# EAGLE design weather_station (EAGLE 9.6.2)
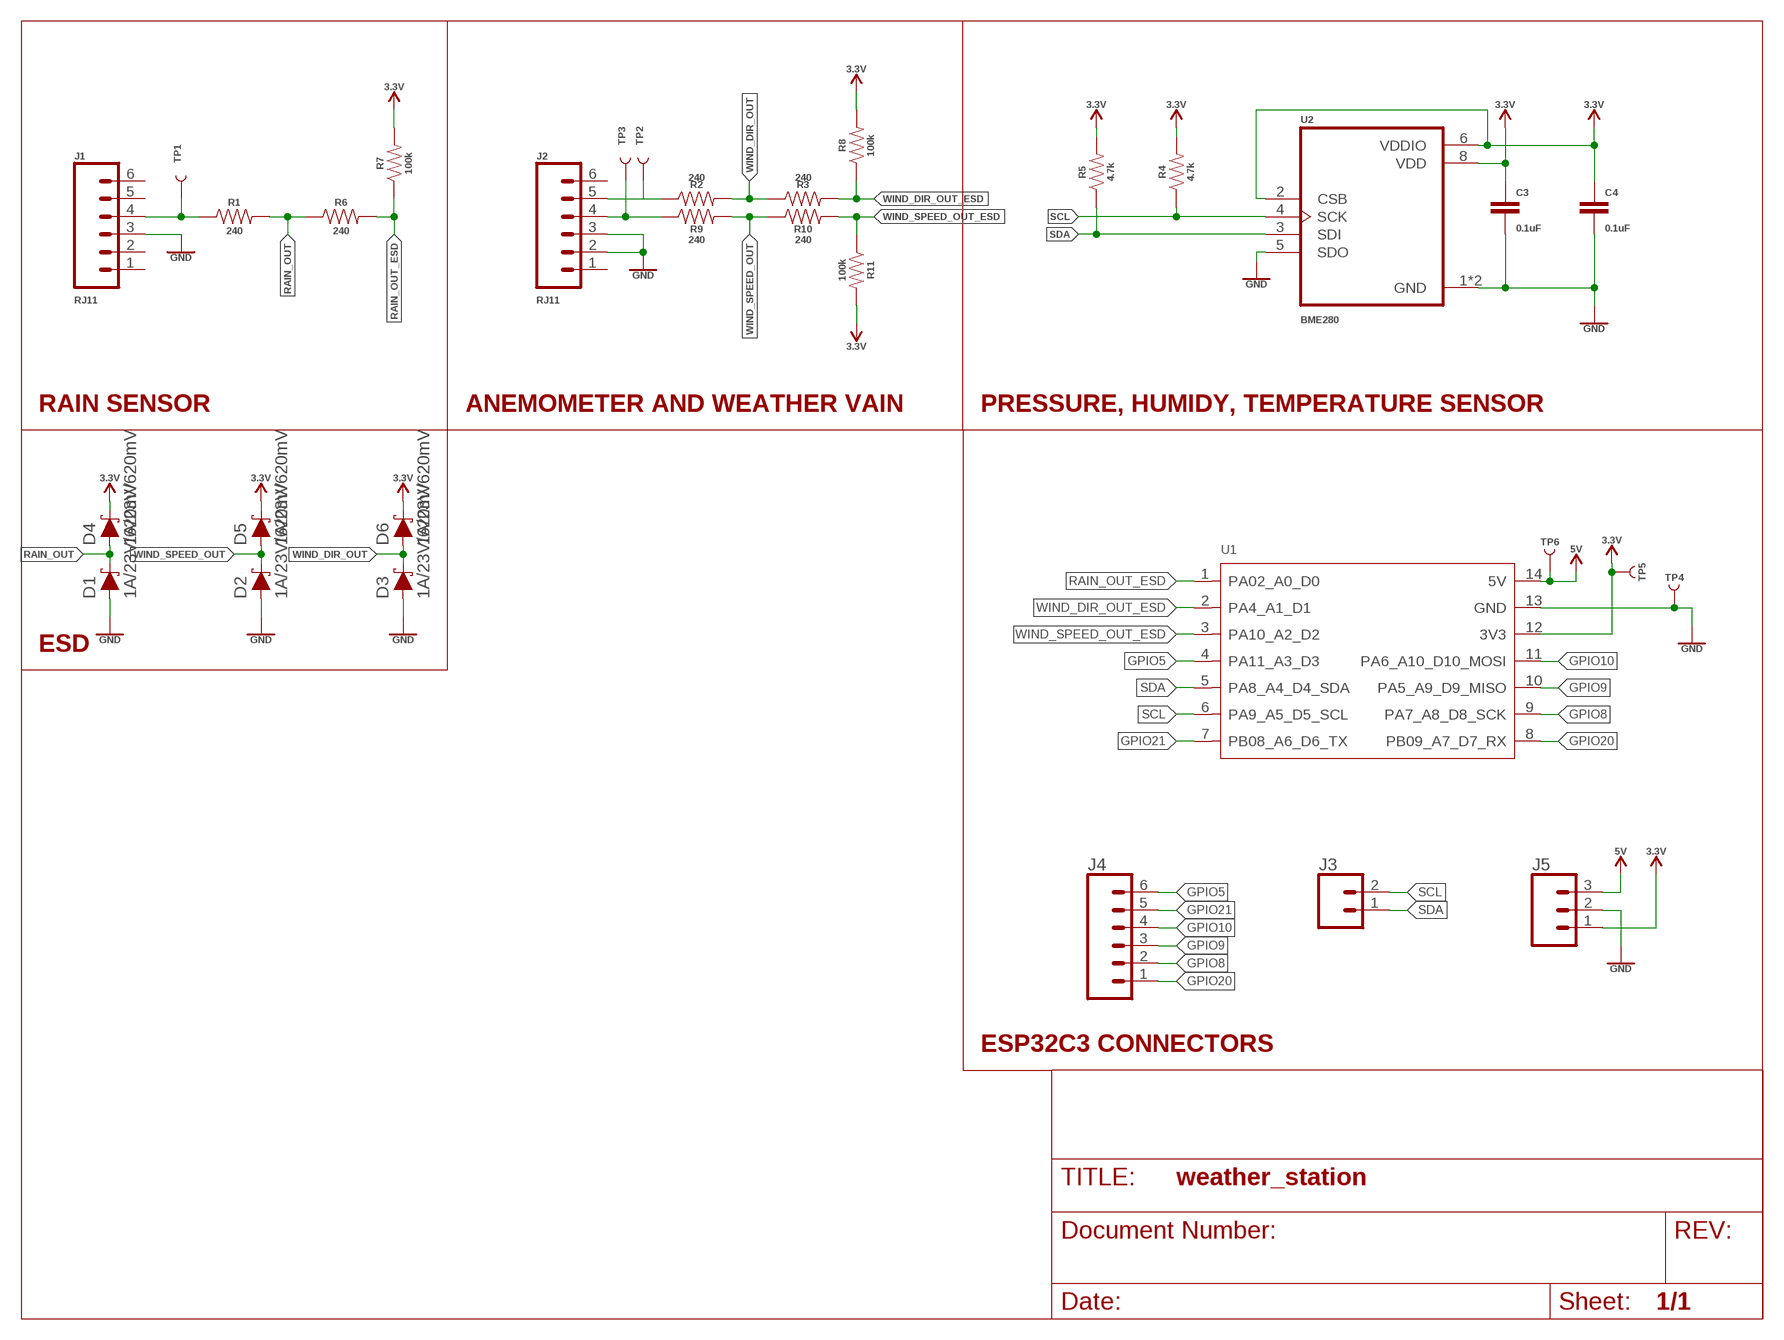
[diagram p0: schematic, sheet 1]

## Parts
C3  0.1uF  0.1UF-0603-25V-(+80/-20%)  [0603]
C4  0.1uF  0.1UF-0603-25V-(+80/-20%)  [0603]
D1  1A/23V/620mV  DIODE-SCHOTTKY-BAT20J  [SOD-323]
D2  1A/23V/620mV  DIODE-SCHOTTKY-BAT20J  [SOD-323]
D3  1A/23V/620mV  DIODE-SCHOTTKY-BAT20J  [SOD-323]
D4  1A/23V/620mV  DIODE-SCHOTTKY-BAT20J  [SOD-323]
D5  1A/23V/620mV  DIODE-SCHOTTKY-BAT20J  [SOD-323]
D6  1A/23V/620mV  DIODE-SCHOTTKY-BAT20J  [SOD-323]
J1  RJ11  RJ11-6  [RJ11-6]
J2  RJ11  RJ11-6  [RJ11-6]
J3  CONN_02  [1X02]
J4  CONN_06SILK_FEMALE_PTH  [1X06]
J5  CONN_03  [1X03]
R1  240  240OHM-0603-1/10W-1%  [0603]
R2  240  240OHM-0603-1/10W-1%  [0603]
R3  240  240OHM-0603-1/10W-1%  [0603]
R4  4.7k  4.7KOHM-0603-1/10W-1%  [0603]
R5  4.7k  4.7KOHM-0603-1/10W-1%  [0603]
R6  240  240OHM-0603-1/10W-1%  [0603]
R7  100k  100KOHM-0603-1/10W-1%  [0603]
R8  100k  100KOHM-0603-1/10W-1%  [0603]
R9  240  240OHM-0603-1/10W-1%  [0603]
R10  240  240OHM-0603-1/10W-1%  [0603]
R11  100k  100KOHM-0603-1/10W-1%  [0603]
TP1  TEST-POINT3  [PAD.03X.03]
TP2  TEST-POINT3  [PAD.03X.03]
TP3  TEST-POINT3  [PAD.03X.03]
TP4  TEST-POINT3  [PAD.03X.03]
TP5  TEST-POINT3  [PAD.03X.03]
TP6  TEST-POINT3  [PAD.03X.03]
U1  MODULE-SEEEDUINO-XIAO-ESP32C3-PIN  [MODULE14P-2.54-21X17.8MM]
U2  BME280  [PSON65P250X250X100-8N]

## Nets
3.3V [power]: C3.1 C4.1 D4.C D5.C D6.C J5.1 R4.2 R5.2 R7.2 R8.2 R11.2 TP5.P$1 U1.12(3V3) U2.2(CSB) U2.6(VDDIO) U2.8(VDD)
5V [power]: J5.3 TP6.P$1 U1.14(5V)
GND [power]: C3.2 C4.2 D1.A D2.A D3.A J1.3 J2.2 J2.3 J5.2 TP4.P$1 U1.13(GND) U2.1(GND) U2.5(SDO) U2.7(GND)
GPIO5 [signal]: J4.6 U1.4(PA11_A3_D3)
GPIO8 [signal]: J4.2 U1.9(PA7_A8_D8_SCK)
GPIO9 [signal]: J4.3 U1.10(PA5_A9_D9_MISO)
GPIO10 [signal]: J4.4 U1.11(PA6_A10_D10_MOSI)
GPIO20 [signal]: J4.1 U1.8(PB09_A7_D7_RX)
GPIO21 [signal]: J4.5 U1.7(PB08_A6_D6_TX)
RAIN_OUT [signal]: D1.C D4.A R1.2 R6.1
RAIN_OUT_ESD [signal]: R6.2 R7.1 U1.1(PA02_A0_D0)
RAIN_RAW [signal]: J1.4 R1.1 TP1.P$1
SCL [signal]: J3.2 R4.1 U1.6(PA9_A5_D5_SCL) U2.4(SCK)
SDA [signal]: J3.1 R5.1 U1.5(PA8_A4_D4_SDA) U2.3(SDI)
WIND_DIR_OUT [signal]: D3.C D6.A R2.2 R3.1
WIND_DIR_OUT_ESD [signal]: R3.2 R8.1 U1.2(PA4_A1_D1)
WIND_DIR_RAW [signal]: J2.5 R2.1 TP2.P$1
WIND_SPEED_OUT [signal]: D2.C D5.A R9.2 R10.1
WIND_SPEED_OUT_ESD [signal]: R10.2 R11.1 U1.3(PA10_A2_D2)
WIND_SPEED_RAW [signal]: J2.4 R9.1 TP3.P$1
Unconnected: J1.1 J1.2 J1.5 J1.6 J2.1 J2.6

## Notes on the sheet
- RAIN SENSOR | ANEMOMETER AND WEATHER VAIN | PRESSURE, HUMIDY, TEMPERATURE SENSOR
- ESD
- ESP32C3 CONNECTORS

## Library data of the parts
C3 C4 = SparkFun-Capacitors:0.1UF: 0.1µF ceramic capacitors A capacitor is a passive two-terminal electrical component used to store electrical energy temporarily in an electric field.; PROD_ID: CAP-00810
D1-D6 = SparkFun-DiscreteSemi:DIODE-SCHOTTKY: Schottky diode A Schottky diode is a semiconductor diode which has a low forward voltage drop and a very fast switching action.; PROD_ID: DIO-11623
J1 J2 = SparkFun-Connectors:RJ11-6: RJ11 Jack - 6 pin Commonly found on CAT3 devices and some Microchip programmers. Here is the connector we sell at SparkFun: RJ11 6-Pin Connector <https://www.sparkfun.com/products/132> (PRT-00132) Datasheet <http://www.sparkfun.com/datasheets/Prototyping/Connectors/RJ11-Datasheet.pdf> It is used on this SparkFun product: SparkFun Weather Shield <https://www.sparkfun.com/products/12081> (DEV-12081) Weather Meters <https://www.sparkfun.com/products/8942> (SEN-08942); PROD_ID: CONN-08590; SF_ID: PRT-00132
J3 = SparkFun-Connectors:CONN_02: Multi connection point. Often used as Generic Header-pin footprint for 0.1 inch spaced/style header connections On any of the 0.1 inch spaced packages, you can populate with these: Break Away Headers - Straight <https://www.sparkfun.com/products/116> (PRT-00116) Break Away Male Headers - Right Angle <https://www.sparkfun.com/products/553> (PRT-00553) Female Headers <https://www.sparkfun.com/products/115> (PRT-00115) Break Away Headers - Machine Pin <https://www.sparkfun.com/products/117> (PRT-00117) Break Away Female Headers - Swiss Machine Pin <https://www.sparkfun.com/products/743> (PRT-00743) For SCREWTERMINALS and SPRING TERMINALS visit here: Screw Terimnals on SparkFun.com <https://www.sparkfun.com/search/results?term=Screw+Terminals> (5mm/3.5mm/2.54mm spacing) This device is also useful as a general connection point to wire up your design to another part of your project. Our various solder wires solder well into these plated through hole pads. Hook-Up Wire - Assortment (Stranded, 22 AWG) <https://www.sparkfun.com/products/11375> (PRT-11375) Hook-Up Wire - Assortment (Solid Core, 22 AWG) <https://www.sparkfun.com/products/11367> (PRT-11367) View the entire wire category on our website here <https://www.sparkfun.com/categories/141> Special notes: Molex polarized connector foot print use with: PRT-08233 with associated crimp pins and housings. 2.54_SCREWTERM for use with PRT-10571. 3.5mm Screw Terminal footprints for PRT-08084 5mm Screw Terminal footprints for use with PRT-08432
J4 = SparkFun-Connectors:CONN_06: Multi connection point. Often used as Generic Header-pin footprint for 0.1 inch spaced/style header connections On any of the 0.1 inch spaced packages, you can populate with these: Break Away Headers - Straight <https://www.sparkfun.com/products/116> (PRT-00116) Break Away Male Headers - Right Angle <https://www.sparkfun.com/products/553> (PRT-00553) Female Headers <https://www.sparkfun.com/products/115> (PRT-00115) Break Away Headers - Machine Pin <https://www.sparkfun.com/products/117> (PRT-00117) Break Away Female Headers - Swiss Machine Pin <https://www.sparkfun.com/products/743> (PRT-00743) Arduino Stackable Header - 6 Pin <https://www.sparkfun.com/products/9280> (PRT-09280) For SCREWTERMINALS and SPRING TERMINALS visit here: Screw Terimnals on SparkFun.com <https://www.sparkfun.com/search/results?term=Screw+Terminals> (5mm/3.5mm/2.54mm spacing) This device is also useful as a general connection point to wire up your design to another part of your project. Our various solder wires solder well into these plated through hole pads. Hook-Up Wire - Assortment (Stranded, 22 AWG) <https://www.sparkfun.com/products/11375> (PRT-11375) Hook-Up Wire - Assortment (Solid Core, 22 AWG) <https://www.sparkfun.com/products/11367> (PRT-11367) View the entire wire category on our website here <https://www.sparkfun.com/categories/141>; PROD_ID: CONN-08437
J5 = SparkFun-Connectors:CONN_03: Multi connection point. Often used as Generic Header-pin footprint for 0.1 inch spaced/style header connections On any of the 0.1 inch spaced packages, you can populate with these: Break Away Headers - Straight <https://www.sparkfun.com/products/116> (PRT-00116) Break Away Male Headers - Right Angle <https://www.sparkfun.com/products/553> (PRT-00553) Female Headers <https://www.sparkfun.com/products/115> (PRT-00115) Break Away Headers - Machine Pin <https://www.sparkfun.com/products/117> (PRT-00117) Break Away Female Headers - Swiss Machine Pin <https://www.sparkfun.com/products/743> (PRT-00743) Stackable Header - 3 Pin (Female, 0.1") <https://www.sparkfun.com/products/13875> (PRT-13875) For SCREWTERMINALS and SPRING TERMINALS visit here: Screw Terimnals on SparkFun.com <https://www.sparkfun.com/search/results?term=Screw+Terminals> (5mm/3.5mm/2.54mm spacing) This device is also useful as a general connection point to wire up your design to another part of your project. Our various solder wires solder well into these plated through hole pads. Hook-Up Wire - Assortment (Stranded, 22 AWG) <https://www.sparkfun.com/products/11375> (PRT-11375) Hook-Up Wire - Assortment (Solid Core, 22 AWG) <https://www.sparkfun.com/products/11367> (PRT-11367) View the entire wire category on our website here <https://www.sparkfun.com/categories/141> Special notes: Molex polarized connector foot print use with SKU : PRT-08232 with associated crimp pins and housings.
R1-R3 R6 R9 R10 = SparkFun-Resistors:240OHM: 240Ω resistor A resistor is a passive two-terminal electrical component that implements electrical resistance as a circuit element. Resistors act to reduce current flow, and, at the same time, act to lower voltage levels within circuits. - Wikipedia; PROD_ID: RES-07849
R4 R5 = SparkFun-Resistors:4.7KOHM: 4.7kΩ resistor A resistor is a passive two-terminal electrical component that implements electrical resistance as a circuit element. Resistors act to reduce current flow, and, at the same time, act to lower voltage levels within circuits. - Wikipedia; PROD_ID: RES-07857
R7 R8 R11 = SparkFun-Resistors:100KOHM: 100kΩ resistor A resistor is a passive two-terminal electrical component that implements electrical resistance as a circuit element. Resistors act to reduce current flow, and, at the same time, act to lower voltage levels within circuits. - Wikipedia; PROD_ID: RES-07828
TP1-TP6 = SparkFun-Connectors:TEST-POINT: SparkFun Test Points Bare copper test points for troubleshooting or In-Circuit-Testing. These are used by our Production team for verifying production board runs using pogo-pins on test beds. SparkFun Products: SparkFun LSM9DS1 Breakout <https://www.sparkfun.com/products/13284> SparkFun PSOC <https://www.sparkfun.com/products/13714> SparkFun Load Cell Amplifier <https://www.sparkfun.com/products/13879>
U1 = Weather Station Library:MODULE-SEEEDUINO-XIAO-ESP32C3
U2 = BME280:BME280: DIGITAL HUMIDITY, PRESSURE AND TEMPERATURE SENSOR * Digital interface I²C (up to 3.4 MHz) and SPI (3 and 4 wire, up to 10 MHz)* Supply voltage VDD main supply voltage range: 1.71 V to 3.6 V*VDDIO interface voltage range: 1.2 V to 3.6 V Operating range -40…+85 °C, 0…100 % rel. humidity, 300…1100 hPa The library has been designed by Richard Magdycz <https://www.facebook.com/groups/eaglecadsoftUK>; DESCRIPTION: Board Mount Humidity Sensors MEMS humidity, pressure and temperature sensor; DIGI-KEY_PART_NUMBER: 828-1063-2-ND; MF: Bosch; MP: BME280; PACKAGE: LGA-8 Bosch; PURCHASE-URL: https://pricing.snapeda.com/search/part/BME280/?ref=eda

## Net classes
1 power: width 0.508 mm
2 signal: width 0.152 mm, drill 0.33 mm

## Board
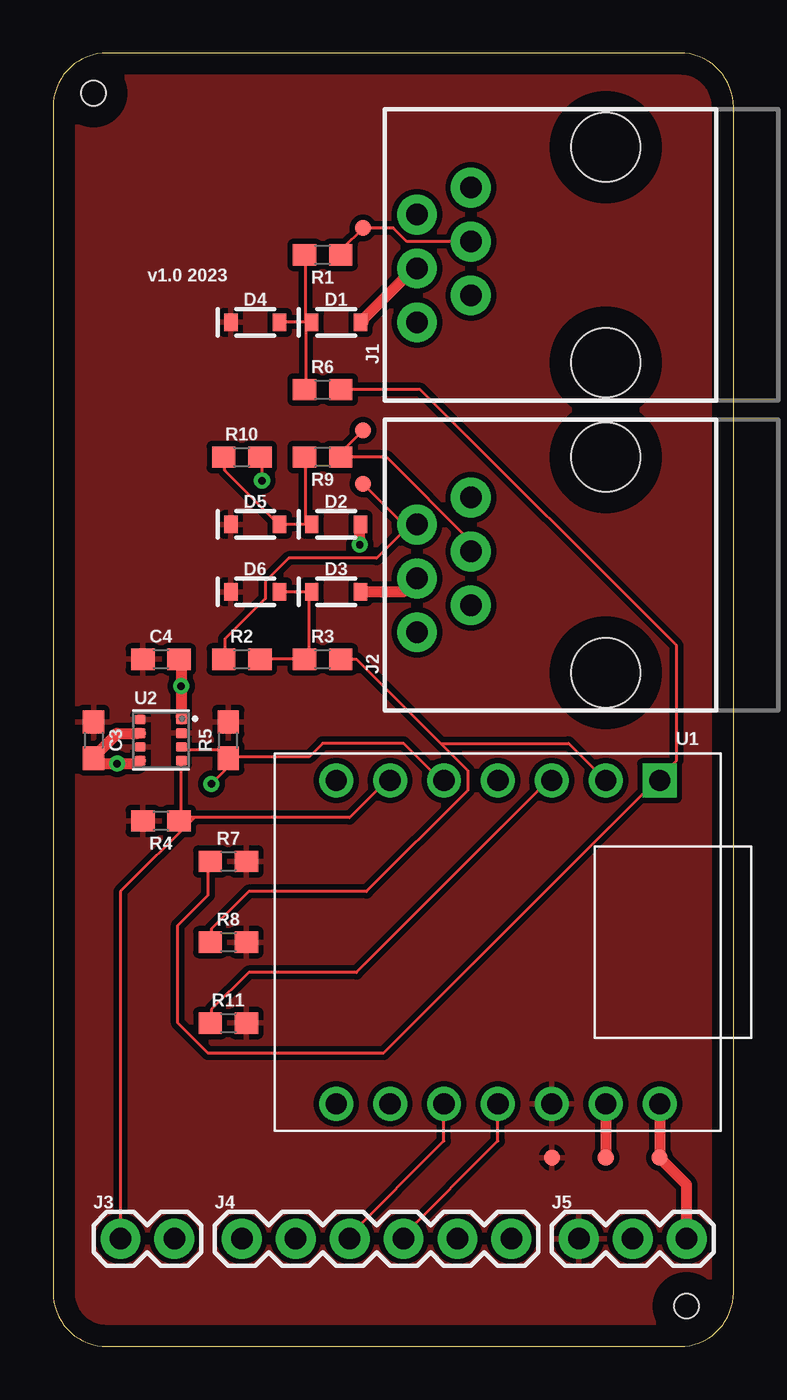
[diagram p1: board, top side]
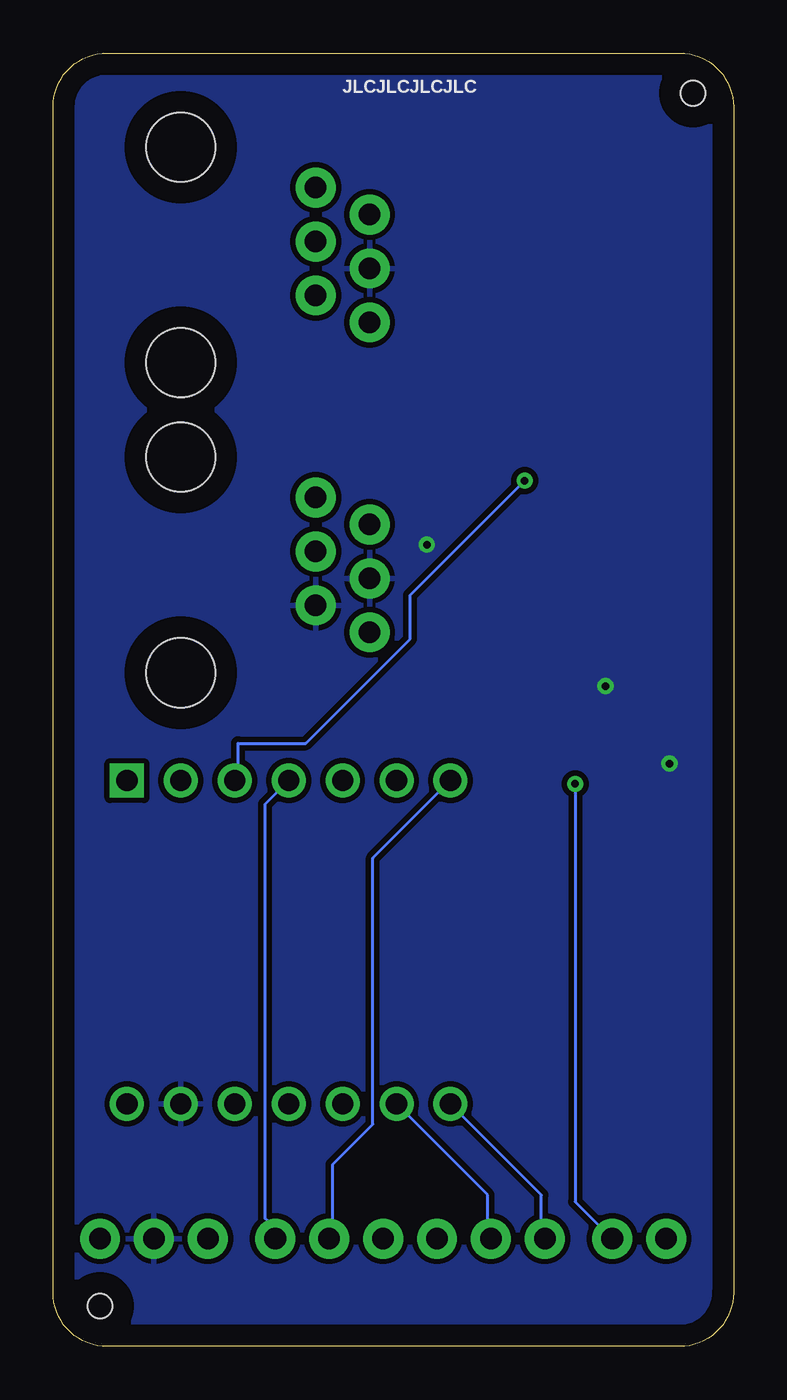
[diagram p2: board, bottom side, seen from below]

Size 32.05 x 60.95 mm. Coordinates in mm from the lower left corner, seen from the top.
Outline: 0,58.41 0,2.54 arc90 2.54,0 29.51,0 arc90 32.05,2.54 32.05,58.41 arc90 29.51,60.95 2.54,60.95 arc90 0,58.41
Copper layers (1*16): Top 0.035mm / dielectric 1.5mm / Bottom 0.035mm
Design rules "default *": minimum track width 6mil, minimum drill 0.35mm, track to track 6mil, track to pad 6mil, pad to pad 6mil, via to via 6mil, smd to smd 6mil, copper to edge 40mil, drill to drill 6mil, minimum pad ring 10mil, minimum via ring 8mil, stop-mask expansion 4mil, vias tented up to drill 0mil, thermal gap 10mil
Holes 1.15 mm at 1.91,59.05 29.84,1.91

### Footprints (pad centres in the part's own frame; a part is rotated, then mirrored left to right if it is on the bottom)
0603 = smd 1.1 x 1: 1 -0.85,0; 2 0.85,0
SOD-323 = smd 0.63 x 0.83: A 1.15,0; C -1.15,0
RJ11-6 = drill 1.016 pad 1.88: 1 -3.175,8.89; 2 -1.905,6.35; 3 -0.635,8.89; 4 0.635,6.35; 5 1.905,8.89; 6 3.175,6.35 | hole 3.251: -5.08,0; 5.08,0
1X02 = drill 1.016 pad 1.88: 1 0,0; 2 2.54,0
1X06 = drill 1.016 pad 1.88: 1 0,0; 2 2.54,0; 3 5.08,0; 4 7.62,0; 5 10.16,0; 6 12.7,0
1X03 = drill 1.016 pad 1.88: 1 0,0; 2 2.54,0; 3 5.08,0
PAD.03X.03 = smd 0.762 x 0.762: P$1 0,0
MODULE14P-2.54-21X17.8MM = drill 1 pad 1.6 square: 1 7.62,7.62 | drill 1 pad 1.6: 2 5.08,7.62; 3 2.54,7.62; 4 0,7.62; 5 -2.54,7.62; 6 -5.08,7.62; 7 -7.62,7.62; 8 -7.62,-7.62; 9 -5.08,-7.62; 10 -2.54,-7.62; 11 0,-7.62; 12 2.54,-7.62; 13 5.08,-7.62; 14 7.62,-7.62
PSON65P250X250X100-8N = smd 0.49 x 0.45: 1 0.97,0.975; 2 0.97,0.325; 3 0.97,-0.325; 4 0.97,-0.975; 5 -0.97,-0.975; 6 -0.97,-0.325; 7 -0.97,0.325; 8 -0.97,0.975

### Placement (x,y rotation side)
C3  1.91,28.58 270 top
C4  5.08,32.38 0 top
D1  13.34,48.26 0 top
D2  13.34,38.73 0 top
D3  13.34,35.56 0 top
D4  9.52,48.26 0 top
D5  9.52,38.73 0 top
D6  9.52,35.56 0 top
J1  26.04,51.43 90 top
J2  26.04,36.83 90 top
J3  5.71,5.08 180 top
J4  8.89,5.08 0 top
J5  24.76,5.08 0 top
R1  12.7,51.43 180 top
R2  8.89,32.38 0 top
R3  12.7,32.38 0 top
R4  5.08,24.77 180 top
R5  8.25,28.58 90 top
R6  12.7,45.09 0 top
R7  8.25,22.86 0 top
R8  8.25,19.05 0 top
R9  12.7,41.91 180 top
R10  8.89,41.91 0 top
R11  8.25,15.24 0 top
TP1  14.6,52.71 0 top
TP2  14.6,40.64 0 top
TP3  14.6,43.18 0 top
TP4  26.04,8.89 0 top
TP5  23.49,8.89 0 top
TP6  28.57,8.89 0 top
U1  20.96,19.05 0 top
U2  5.08,28.58 0 top

### Tracks (layer width: path | path; a pad name or v marks a point on that pad's centre or on a via)
3.3V
  pour Top (isolate 0.254): 1.91,62.23 -0.63,59.69 -0.63,-1.27 0.63,-2.54 33.65,-2.54 37.46,1.27 37.46,62.23
5V
  Top 0.508: U1.14 TP6.P$1 29.84,7.62 J5.3
GND  (via drill 0.35)
  Top 0.508: U2.5 3.97,27.46 v3.02,27.46 2.06,27.46 1.91,27.62 C3.2 1.91,27.78 3.02,28.89 3.97,28.89 U2.7 | U2.1 6.03,29.69 v6.03,31.12 6.03,32.38 C4.2 | U1.13 TP4.P$1 | D3.A 16.51,35.56 J2.3 | v14.45,37.78 14.45,38.73 D2.A | J1.3 16.99,50.8 14.6,48.42 14.6,48.26 D1.A
  pour Bottom (isolate 0.254): -3.18,60.96 -3.18,-3.81 -1.91,-5.08 -0.63,-6.35 41.27,-6.35 41.27,63.5 40.01,64.77 38.73,66.04 -1.91,66.04 -3.18,64.77
GPIO5
  Bottom 0.152: U1.4 22.07,25.56 22.07,6.03 21.59,5.56 J4.6
GPIO8
  Bottom 0.152: U1.9 11.59,7.14 11.59,5.24 J4.2
GPIO9
  Top 0.152: U1.10 18.41,9.68 13.97,5.24 J4.3
GPIO10
  Top 0.152: U1.11 20.96,9.68 16.51,5.24 J4.4
GPIO20
  Bottom 0.152: U1.8 9.05,7.14 9.05,5.24 J4.1
GPIO21
  Bottom 0.152: U1.7 16.99,23.02 16.99,10.48 18.89,8.57 18.89,5.24 J4.5
RAIN_OUT
  Top 0.152: 11.91,48.26 12.07,48.26 D1.C | 11.91,48.26 D4.A | 11.91,48.26 11.91,45.09 R6.1 | 11.91,48.26 11.91,51.43 R1.2
RAIN_OUT_ESD
  Top 0.152: 28.42,26.67 15.56,13.81 7.3,13.81 5.87,15.24 5.87,19.84 7.3,21.27 7.3,22.86 R7.1 | R6.2 17.3,45.09 29.37,33.02 29.37,27.62 28.42,26.67 | 28.42,26.67 U1.1
RAIN_RAW
  Top 0.152: R1.1 13.65,51.43 13.65,51.75 TP1.P$1 16.03,52.71 16.67,52.07 J1.4
SCL
  Top 0.152: 6.03,24.92 6.03,24.77 R4.1 6.03,24.92 | 6.03,24.92 6.03,27.46 U2.4 | 6.67,24.92 13.97,24.92 15.72,26.67 U1.6 | 6.67,24.92 6.03,24.92 | J3.2 3.17,21.43 6.67,24.92
SDA  (via drill 0.35)
  Top 0.152: 8.25,27.78 7.94,28.1 6.19,28.1 U2.3 | 8.73,27.78 12.07,27.78 12.7,28.42 16.51,28.42 18.26,26.67 U1.5 | 8.73,27.78 8.25,27.78 | 8.25,27.78 R5.1 8.73,27.78 | 8.73,27.78 v7.46,26.51
  Bottom 0.152: J3.1 7.46,6.83 v7.46,26.51
WIND_DIR_OUT
  Top 0.152: 12.07,35.56 D6.A | R2.2 R3.1 11.91,32.38 12.07,32.54 12.07,35.56 | 12.07,35.56 D3.C
WIND_DIR_OUT_ESD
  Top 0.152: 18.26,28.42 14.29,32.38 R3.2 | 18.26,28.42 19.53,27.15 19.53,26.19 14.76,21.43 9.21,21.43 7.46,19.69 7.46,19.05 R8.1 | U1.2 24.29,28.42 18.26,28.42
WIND_DIR_RAW
  Top 0.152: TP2.P$1 16.51,38.73 16.83,38.73 | 16.83,38.73 15.24,37.15 11.11,37.15 10,36.04 10,35.24 8.1,33.34 8.1,32.38 R2.1 | 16.83,38.73 J2.5
WIND_SPEED_OUT
  Top 0.152: D2.C 11.91,38.73 | 11.91,38.73 D5.A 10.64,38.73 8.1,41.27 8.1,41.91 R10.1 | 11.91,38.73 11.91,41.91 R9.2
WIND_SPEED_OUT_ESD  (via drill 0.35)
  Top 0.152: U1.3 23.34,26.67 14.29,17.62 9.21,17.62 7.46,15.88 7.46,15.24 R11.1 | v9.84,40.8 9.84,41.91 R10.2
  Bottom 0.152: v9.84,40.8 15.24,35.4 15.24,33.34 20.16,28.42 23.34,28.42 23.34,26.83 U1.3
WIND_SPEED_RAW
  Top 0.152: TP3.P$1 13.65,42.23 13.65,41.91 | 13.65,41.91 15.72,41.91 19.68,37.94 J2.4 | 13.65,41.91 R9.1

### Text on the board
tNames: v1.0 2023
bNames: JLCJLCJLCJLC